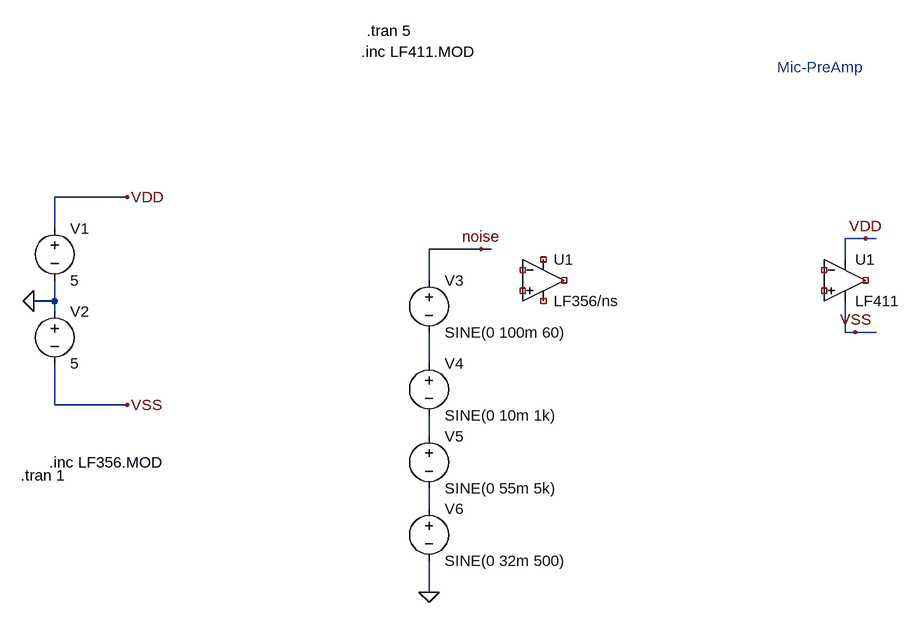
[diagram p0: schematic Analog_ANC.asc]
Analog_ANC.asc, the LTspice schematic file:
Version 4.1
SHEET 1 1276 680
WIRE -464 0 -576 0
WIRE -576 48 -576 0
WIRE 672 64 640 64
WIRE 688 64 672 64
WIRE 80 80 0 80
WIRE 96 80 80 80
WIRE 640 96 640 64
WIRE 0 128 0 80
WIRE -576 160 -576 128
WIRE -576 160 -608 160
WIRE -576 176 -576 160
WIRE 640 208 640 160
WIRE 656 208 640 208
WIRE 688 208 656 208
WIRE 0 256 0 208
WIRE -576 320 -576 256
WIRE -464 320 -576 320
WIRE 0 368 0 336
WIRE 0 480 0 448
WIRE 0 608 0 560
FLAG -608 160 0
FLAG -464 0 VDD
FLAG -464 320 VSS
<<<<<<< HEAD
SYMBOL OpAmps\\opamp2 176 64 R0
SYMATTR InstName U1
SYMATTR Value LF356/ns
=======
FLAG 0 608 0
FLAG 80 80 noise
FLAG 672 64 VDD
FLAG 656 208 VSS
>>>>>>> b92e82f0ae8c1893548455cdfa21a64dc6642385
SYMBOL voltage -576 32 R0
WINDOW 123 0 0 Left 0
WINDOW 39 0 0 Left 0
SYMATTR InstName V1
SYMATTR Value 5
SYMBOL voltage -576 160 R0
WINDOW 123 0 0 Left 0
WINDOW 39 0 0 Left 0
SYMATTR InstName V2
SYMATTR Value 5
<<<<<<< HEAD
TEXT -584 408 Left 2 !.inc LF356.MOD
TEXT -628 428 Left 2 !.tran 1
=======
SYMBOL voltage 0 112 R0
WINDOW 123 0 0 Left 0
WINDOW 39 0 0 Left 0
SYMATTR InstName V3
SYMATTR Value SINE(0 100m 60)
SYMBOL voltage 0 240 R0
WINDOW 123 0 0 Left 0
WINDOW 39 0 0 Left 0
SYMATTR InstName V4
SYMATTR Value SINE(0 10m 1k)
SYMBOL voltage 0 352 R0
WINDOW 123 0 0 Left 0
WINDOW 39 0 0 Left 0
SYMATTR InstName V5
SYMATTR Value SINE(0 55m 5k)
SYMBOL voltage 0 464 R0
WINDOW 123 0 0 Left 0
WINDOW 39 0 0 Left 0
SYMATTR InstName V6
SYMATTR Value SINE(0 32m 500)
SYMBOL OpAmps\\opamp2 640 64 R0
SYMATTR InstName U1
SYMATTR Value LF411
TEXT 536 -200 Left 2 ;Mic-PreAmp
TEXT -96 -256 Left 2 !.tran 5
TEXT -104 -224 Left 2 !.inc LF411.MOD
>>>>>>> b92e82f0ae8c1893548455cdfa21a64dc6642385

The netlist it stands for:
* Analog_ANC.asc
X§U1 NC_01 NC_02 NC_03 NC_04 NC_05 LF356/ns  ; pins In+ In- V+ V- OUT
V1 VDD 0 5
V2 0 VSS 5
V3 noise N001 SINE(0 100m 60)
V4 N001 N002 SINE(0 10m 1k)
V5 N002 N003 SINE(0 55m 5k)
V6 N003 0 SINE(0 32m 500)
X§U1 NC_06 NC_07 VDD VSS NC_08 LF411  ; pins In+ In- V+ V- OUT
.inc LF356.MOD
.tran 1
* Mic-PreAmp
.tran 5
.inc LF411.MOD
.backanno
.end